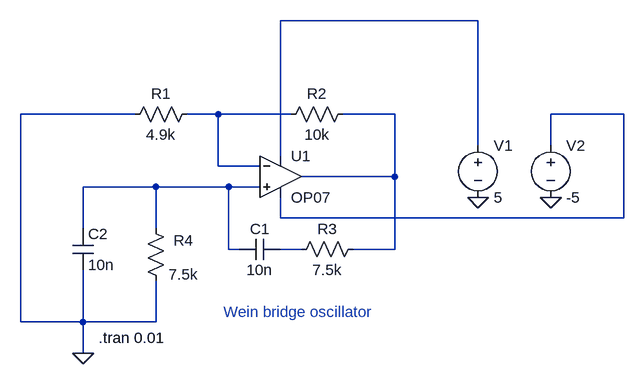
[diagram p0: schematic wein Bridge.asc]
wein Bridge.asc, the LTspice schematic file:
Version 4.1
SHEET 1 880 680
WIRE 608 -48 304 -48
WIRE 80 96 -96 96
WIRE 208 96 160 96
WIRE 320 96 208 96
WIRE 480 96 400 96
WIRE 832 96 720 96
WIRE 608 144 608 -48
WIRE 720 144 720 96
WIRE 304 160 304 -48
WIRE 208 176 208 96
WIRE 272 176 208 176
WIRE 480 192 480 96
WIRE 480 192 336 192
WIRE 112 208 0 208
WIRE 224 208 112 208
WIRE 272 208 224 208
WIRE 304 256 304 224
WIRE 832 256 832 96
WIRE 832 256 304 256
WIRE 0 272 0 208
WIRE 112 272 112 208
WIRE 224 304 224 208
WIRE 240 304 224 304
WIRE 336 304 304 304
WIRE 480 304 480 192
WIRE 480 304 416 304
WIRE -96 416 -96 96
WIRE 0 416 0 336
WIRE 0 416 -96 416
WIRE 112 416 112 352
WIRE 112 416 0 416
WIRE 0 464 0 416
FLAG 608 224 0
FLAG 720 224 0
FLAG 0 464 0
SYMBOL res 176 80 R90
WINDOW 0 0 56 VBottom 2
WINDOW 3 32 56 VTop 2
SYMATTR InstName R1
SYMATTR Value 4.9k
SYMBOL res 416 80 R90
WINDOW 0 0 56 VBottom 2
WINDOW 3 32 56 VTop 2
SYMATTR InstName R2
SYMATTR Value 10k
SYMBOL res 432 288 R90
WINDOW 0 0 56 VBottom 2
WINDOW 3 32 56 VTop 2
SYMATTR InstName R3
SYMATTR Value 7.5k
SYMBOL res 128 368 R180
WINDOW 0 -42 78 Left 2
WINDOW 3 -49 25 Left 2
SYMATTR InstName R4
SYMATTR Value 7.5k
SYMBOL OpAmps\\OP07 304 128 R0
SYMATTR InstName U1
SYMBOL cap 304 288 R90
WINDOW 0 0 32 VBottom 2
WINDOW 3 32 32 VTop 2
SYMATTR InstName C1
SYMATTR Value 10n
SYMBOL cap -16 272 R0
SYMATTR InstName C2
SYMATTR Value 10n
SYMBOL voltage 608 128 R0
WINDOW 123 0 0 Left 0
WINDOW 39 0 0 Left 0
SYMATTR InstName V1
SYMATTR Value 5
SYMBOL voltage 720 128 R0
WINDOW 123 0 0 Left 0
WINDOW 39 0 0 Left 0
SYMATTR InstName V2
SYMATTR Value -5
TEXT 24 440 Left 2 !.tran 0.01
TEXT 216 400 Left 2 ;Wein bridge oscillator

The netlist it stands for:
* wein Bridge.asc
R1 N002 0 4.9k
R2 N003 N002 10k
R3 N003 N006 7.5k
R4 0 N005 7.5k
X§U1 N005 N002 N001 N004 N003 LT1001  ; OP07, pins In+ In- V+ V- OUT
C1 N006 N005 10n
C2 N005 0 10n
V1 N001 0 5
V2 N004 0 -5
.tran 0.01
* Wein bridge oscillator
.lib LTC.lib
.backanno
.end